# Altium schematic sheet Microprocessor.SchDoc
size A4; SheetNumber: 4; SheetTotal: 4
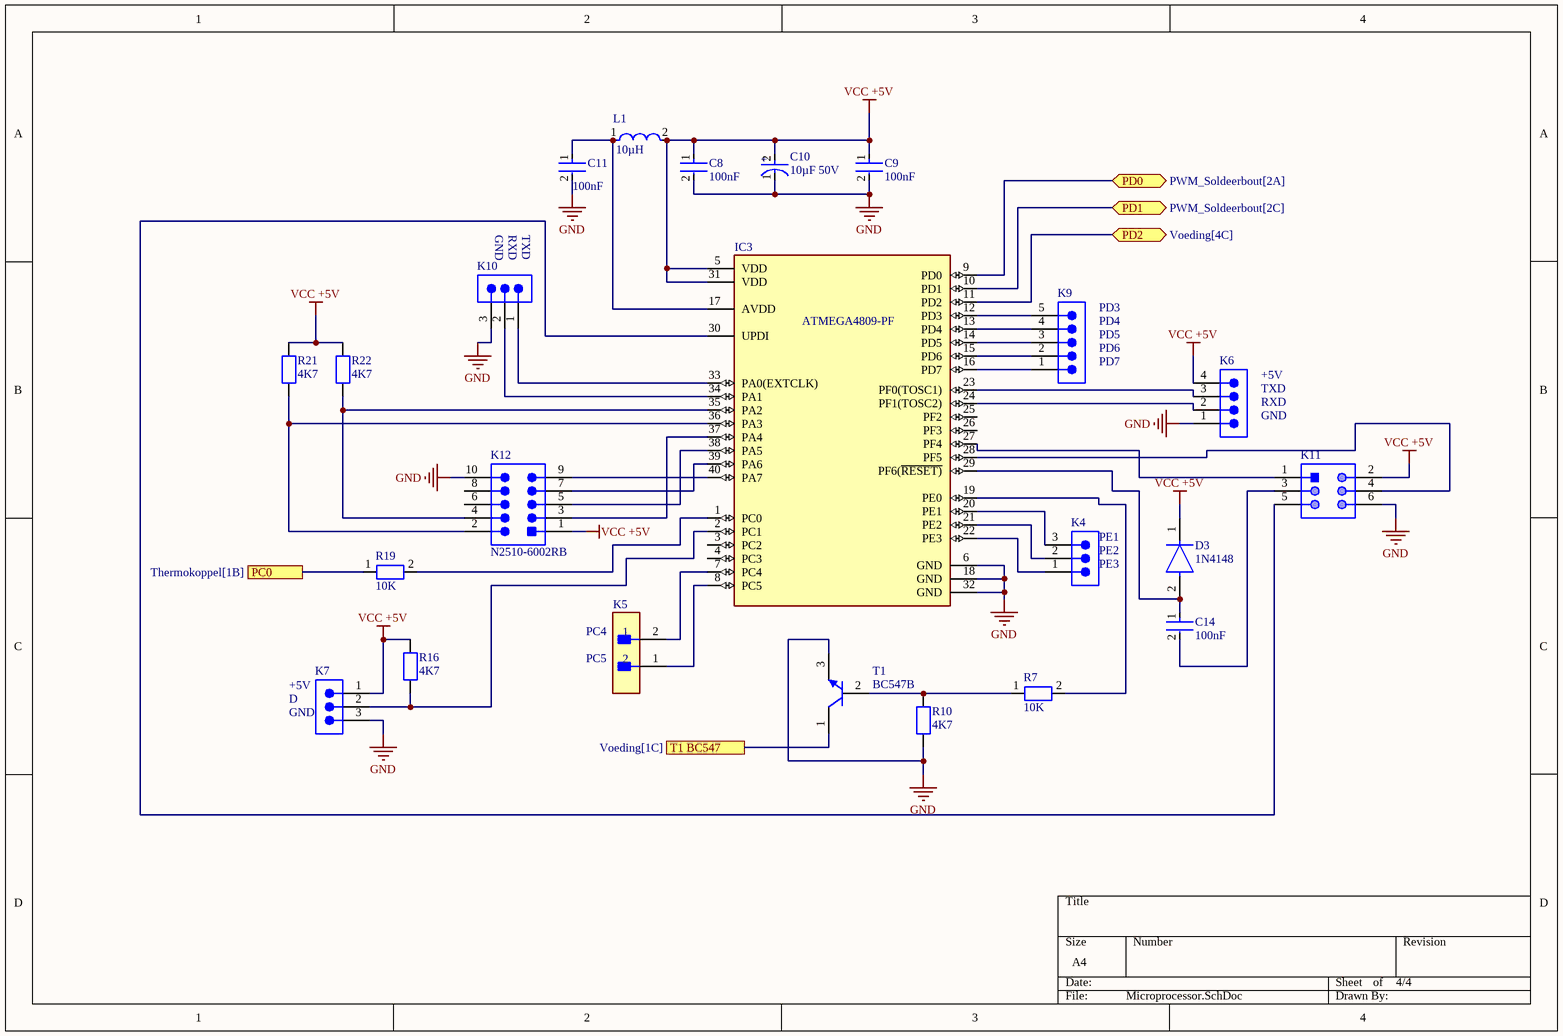
[diagram p0: Microprocessor.SchDoc]

## Parts
C8  100nF  [FP-C0805C-DN-IPC_A]
C9  100nF  [FP-C0805C-DN-IPC_A]
C10  10µF 50V  [cap 10µF 50V]
C11  100nF  [FP-C0805C-DN-IPC_A]
C14  100nF  [FP-C0805C-DN-IPC_A]
D3  1N4148  [1N4148]
IC3  ATMEGA4809-PF  [ATMEGCPU]
K4  (no value)  [Pinheader (1rij-3pin)]
K5  (no value)  [Pinheader (1rij-2pin)]
K6  (no value)  [Pinheader (1rij-4pin)]
K7  (no value)  [Pinheader (1rij-3pin)]
K9  (no value)  [Pinheader (1rij-5pin)]
K10  (no value)  [Pinheader (1rij-3pin)]
K11  (no value)  [Pinheader (2rij-6pin)]
K12  N2510-6002RB  [boxheader]
L1  10µH  [Spoel L1 10µH,130mA]
R7  10K  [Weerstand 1M ohm]
R10  4K7  [Weerstand 1M ohm]
R16  4K7  [Weerstand 1M ohm]
R19  10K  [Weerstand 1M ohm]
R21  4K7  [Weerstand 1M ohm]
R22  4K7  [Weerstand 1M ohm]
T1  BC547B  [sot23]

## Ports
PC0 (see Thermokoppel[1B]), PD0 (bidir, see PWM_Soldeerbout[2A]), PD1 (bidir, see PWM_Soldeerbout[2C]), PD2 (bidir, see Voeding[4C]), T1 BC547 (see Voeding[1C])

## Nets
GND: C8.2 C9.2 C10.1(C) C11.2 IC3.6(GND) IC3.18(GND) IC3.32(GND) K6.1 K7.3 K10.3 K11.6 K12.10 R10.1 T1.3(E)
VCC +5V: C8.1 C9.1 C10.2(A) D3.1(C) IC3.5(VDD) IC3.31(VDD) K6.4 K7.1 K11.2 K12.1 L1.2 R16.2 R21.2 R22.2
PC0: R19.1 ; port PC0
PD0: IC3.9(PD0) ; port PD0
PD1: IC3.10(PD1) ; port PD1
PD2: IC3.11(PD2) ; port PD2
T1 BC547: T1.1(C) ; port T1 BC547
NetC11_1: C11.1 IC3.17(AVDD) L1.1
NetC14_1: C14.1 D3.2(A) IC3.29(PF6(~{RESET)})
NetC14_2: C14.2 K11.3
NetIC3_1: IC3.1(PC0) R19.2
NetIC3_2: IC3.2(PC1) K7.2 R16.1
NetIC3_7: IC3.7(PC4) K5.2
NetIC3_8: IC3.8(PC5) K5.1
NetIC3_12: IC3.12(PD3) K9.5
NetIC3_13: IC3.13(PD4) K9.4
NetIC3_14: IC3.14(PD5) K9.3
NetIC3_15: IC3.15(PD6) K9.2
NetIC3_16: IC3.16(PD7) K9.1
NetIC3_19: IC3.19(PE0) R7.2
NetIC3_20: IC3.20(PE1) K4.3
NetIC3_21: IC3.21(PE2) K4.2
NetIC3_22: IC3.22(PE3) K4.1
NetIC3_23: IC3.23(PF0(TOSC1)) K6.3
NetIC3_24: IC3.24(PF1(TOSC2)) K6.2
NetIC3_27: IC3.27(PF4) K11.1
NetIC3_28: IC3.28(PF5) K11.4
NetIC3_30: IC3.30(UPDI) K11.5
NetIC3_33: IC3.33(PA0(EXTCLK)) K10.1
NetIC3_34: IC3.34(PA1) K10.2
NetIC3_35: IC3.35(PA2) K12.4 R22.1
NetIC3_36: IC3.36(PA3) K12.2 R21.1
NetIC3_37: IC3.37(PA4) K12.3
NetIC3_38: IC3.38(PA5) K12.5
NetIC3_39: IC3.39(PA6) K12.7
NetIC3_40: IC3.40(PA7) K12.9
NetR7_1: R7.1 R10.2 T1.2(B)

Not connected (* = marked no-connect by the designer): IC3 3(PC2) 4(PC3) 25(PF2) 26(PF3); K12 6 8

## Notes on the sheet
- (near K10) GND
- (near K10) RXD
- TXD
- (near K9) PD3
- (near K9) PD4
- (near K9) PD5
- (near K9) PD6
- (near K9) PD7
- (near K6) +5V
- (near K6) TXD
- (near K6) RXD
- GND
- (near K4) PE1
- (near K4) PE2
- (near K4) PE3
- (near K5) PC4
- (near K7) +5V
- (near K7) D
- (near K7) GND
- (near K5) PC5
- (in symbol 10µF 50V) +

## Library data of the parts
C8 C9 C11 C14 = cap 50V 100nF: Chip Multilayer Ceramic Capacitors for Automotive, 0805, 0.10uF, X7R, 15%, 10%, 50V, Grade 1; Case Code (Metric): 2012; Voltage Rating: 50V; Height: 1.25mm; Weight: 0.000335oz; Mount: Surface Mount; Width: 0.049inch; Packaging: Tape and Reel; Min Operating Temperature: -55°C; Depth: 1.25mm; Length: 2mm; Max Operating Temperature: 125°C; Ratings: AEC-Q200; Termination: SMD/SMT; Capacitance: 100nF; Thickness: 0.049inch; Case/Package: 0805; Voltage Rating (DC): 50V; Dielectric: X7R; Case Code (Imperial): 0805; Tolerance: 10%; Package Quantity: 3000
C10 = 10µF 50V: Aluminum Electrolytic Capacitors (Radial Lead Type) 10uF ±20% 50V; Lead Diameter: 0.5mm; Life (Hours): 5000Hour; Impedance: 340mR; Ripple Current (AC): 250mA; REACH SVHC: Yes; Tolerance: 20%; Construction: RADIAL; Min Operating Temperature: -40°C; Termination: Radial; Voltage Rating: 50V; Height: 11mm; Max Operating Temperature: 105°C; Capacitance: 10uF; Voltage: 50V; Diameter: 5mm; Lead Pitch: 2mm; Series: FR Radial; RoHS Compliant: Yes; Case/Package: Radial
D3 = 1N4148: DIODE GEN PURP 100V 200MA DO35; Forward Voltage: 1V; Max Power Dissipation: 500mW; Max Reverse Current: 5uA; Forward Current: 300mA; Current: 4A; Reverse Recovery Time: 4ns; Element Configuration: Single; Outside Diameter: 1.85mm; Capacitance: 4pF; Polarity: Standard; Max Forward Surge Current (Ifsm): 1A; Reverse Voltage: 100V; Output Current: 200mA; Average Rectified Current: 200mA; Diameter: 1.91mm; Max Repetitive Reverse Voltage (Vrrm): 100V; Current Rating: 200mA; Case/Package: DO-35; Lead Free: Lead Free; Number of Pins: 2; Recovery Time: 4ns; Packaging: Bulk; Contact Plating: Tin; Voltage: 100V; Mount: Through Hole; Max Surge Current: 4A; Package Quantity: 2000; Width: 1.91mm; Max Reverse Voltage (DC): 100V; Length: 4.56mm; Radiation Hardening: No; Power Dissipation: 500mW; Voltage Rating (DC): 100V; Peak Non-Repetitive Surge Current: 4A; REACH SVHC: No SVHC; Height: 4.56mm; Max Operating Temperature: 175°C; Series: -; Weight: 0.01lb; Min Operating Temperature: -65°C
IC3 = ATMEGA4809-PF: IC MCU 8BIT 48KB FLASH 40DIP; RoHS Compliant: Yes
K4 K7 K10 = Pinheader (1rij-3pin): 0.025" SQ Post Header, Through-hole, Vertical, -55 to 105 degC, 2.54 mm Pitch, 3-Pin, Male, RoHS; PartNumber: TSW-103-07-T-S; Manufacturer: Samtec; Pitch: 2.54 mm; ComponentLink1URL: http://www.samtec.com; ComponentLink3URL: http://www.samtec.com/documents/webfiles/cpdf/TSW-XXX-XX-XXX-X-XX-XXX-MKT.pdf; Mounting Technology: Through-hole; RoHS: True; DatasheetVersion: F-214; PackageVersion: DM, 8/1988; Temperature Range: -55 to 105 degC; ComponentLink2Description: Datasheet; ComponentLink1Description: Manufacturer URL; Orientation: Vertical; PackageReference: TSW-103-07-X-S; ComponentLink3Description: Package Specification; ComponentLink2URL: http://www.samtec.com/documents/webfiles/pdf/TSW_TH.PDF; PackageDescription: .025[0.64] SQ. Post Terminal Strip Assembly
K5 = Pinheader (1rij-2pin): CONN HEADER VERT 2POS 2.54MM; Manufacturer: Harwin; Manufacturer Part Number: M20-9990246; Conn Gender: Male; Conn Orientation: Vertical; Number Of Contacts: 2; Current Rating: 3A; ComponentLink2URL: https://cdn.harwin.com/pdfs/M20-999.pdf; ComponentLink2Description: Datasheet; Package: M20-9990246; Temperature: -40°C to +105°C; Octopart: https://octopart.com/m20-9990246-harwin-2590635; Mouser Description: 2.54mm (0.1") Pitch SIL Vertical PC Tail Pin Header, 6.1mm mating pin height, tin, 2 contacts; Temperature Range High: +105°C; Device Class L1: Connectors; RoHS: TRUE; Automotive: No; Height: 8.99mm; Number Of Rows: 1; Contact Material: Tin,Nickel; Category: Conn; Pitch: 2.54mm; Lead Free: Yes; Digikey Description: CONN HEADER VERT 2POS 2.54MM; Temperature Range Low: -40°C; Device Class L3: unset; Device Class L2: Headers and Wire Housings
K6 = Pinheader (1rij - 4pin): 0.025" SQ Post Header, Through-hole, Vertical, -55 to 125 degC, 2.54 mm Pitch, 4-Pin, Male, RoHS; PartNumber: TSW-104-08-L-S; Manufacturer: Samtec; Pitch: 2.54 mm; RoHS: True; Temperature Range: -55 to 125 degC; PackageDescription: .025[0.64] SQ. Post Terminal Strip Assembly; Orientation: Vertical; ComponentLink2URL: http://www.samtec.com/documents/webfiles/pdf/TSW_TH.PDF; ComponentLink1Description: Manufacturer URL; ComponentLink2Description: Datasheet; PackageVersion: DM, 8/1988; ComponentLink3URL: http://www.samtec.com/documents/webfiles/cpdf/TSW-XXX-XX-XXX-X-XX-XXX-MKT.pdf; Mounting Technology: Through-hole; PackageReference: TSW-104-08-X-S; ComponentLink3Description: Package Specification; ComponentLink1URL: http://www.samtec.com; DatasheetVersion: F-214
K9 = Pinheader (1rij-5pin): 0.025" SQ Post Header, Through-hole, Vertical, -55 to 125 degC, 2.54 mm Pitch, 5-Pin, Male, RoHS; PartNumber: TSW-105-05-F-S; Manufacturer: Samtec; Pitch: 2.54 mm; PackageReference: TSW-105-05-X-S; ComponentLink1Description: Manufacturer URL; Temperature Range: -55 to 125 degC; ComponentLink2Description: Datasheet; ComponentLink2URL: http://www.samtec.com/documents/webfiles/pdf/TSW_TH.PDF; ComponentLink3URL: http://www.samtec.com/documents/webfiles/cpdf/TSW-XXX-XX-XXX-X-XX-XXX-MKT.pdf; ComponentLink1URL: http://www.samtec.com; DatasheetVersion: F-214; Mounting Technology: Through-hole; RoHS: True; PackageVersion: DM, 8/1988; ComponentLink3Description: Package Specification; PackageDescription: .025[0.64] SQ. Post Terminal Strip Assembly; Orientation: Vertical
K11 = Pinheader (2rij-6pin): THT Vertical Pin Header WR-PHD, Pitch 2.54 mm, Dual Row, 6 pins; Manufacturer: Wurth Elektronik; Part Number: 61300621121; Contact Resistance: 20mOhm; Withstanding Voltage: 500VAC; Pin Number: 6; Gender: Male; Pitch: 2.54mm; Working Voltage: 250VAC; Rated Current: 3A; Packaging: Bag; Row Number: Dual; Manufacturer URL: http://www.we-online.de; Operating Temperature: -40to105degC; Mounting Technology: THT; Package Reference: 61300621121; Datasheet URL: https://katalog.we-online.de/em/datasheet/6130xx21121.pdf; Orientation: Vertical; Publisher: WurthElektronik
K12 = boxheader: Male Header, Pitch 2.54 mm, 2 x 5 Postion, Height 9.91 mm, Tail Length 2.84 mm, -55 to 105 degC, RoHS, Bulk; PartNumber: N2510; Manufacturer: 3M; Package Version: Rev. M, 08/2014; Rad Hard: No; No. of Rows: 2; Number of Contacts: 10; Pitch: 2.54mm; Termination Method: Solder; Manufacturer URL: http://www.3m.com/; Package Description: 10-Pin Through Hole Device, Body 20.02 x 8.59 mm, Pitch 2.54 mm; Gender: Male; Number of Rows: 2; Orientation: Straight; Contact Plating: GoldOverNickel; Packaging: Rail/Tube; Mounting Technology: ThroughHole; Datasheet URL: https://datasheet.ciiva.com/11746/0900766b807b18da-11746957.pdf; Package Reference: N2510-6002-10; Datasheet Version: 05/2007; No. of Positions: 10; Package URL: http://multimedia.3m.com/mws/media/330367O/3mtm-100-in-4-wall-hdr-rohs-lp-straightra-hitemp-ts0770.pdf; Type: ShroudedHeader
L1 = Spoel L1 10µH,130mA: IR-2 10 10% B08; Obsolete Part: true; Manufacturer: Vishay Dale; Manufacturer Part Number: IR02BH100K; Core Material: Iron; Value: 10uH; Test Frequency: 7.9MHz; Saturation Current: 130mA; Series Resistance: 3.7Ω; Q Factor: 55; Self Resonant Frequency: 50MHz; Device Class L2: Inductors; ComponentLink2Description: Datasheet; Temperature Range Low: -55°C; Digikey Description: IR-2 10 10% B08; Temperature Range High: +105°C; Inductance: 10uH; Height: 3.05mm; Package: IR02; Tolerance: 10%; Device Class L1: Passive Components; Category: Ind; Device Class L3: Fixed Inductors; RoHS: TRUE; Octopart: https://octopart.com/ir02bh100k-vishay+dale-39675774; Temperature: -55°C to +105°C; Ipc Land Pattern Name: CAPAD1147W70L838D305; Lead Free: Yes; ComponentLink2URL: https://datasheet.ciiva.com/8536/ir-8536517.pdf; Automotive: No; Mouser Description: Fixed Inductors 10uH 10%
R7 R19 = Weerstand 10K ohm: RES Thick Film, 10kΩ, 1%, 0.125W, 100ppm/°C, 0805; Resistance: 10kR; Voltage Rating (DC): 150V; Power Rating: 125mW; Weight: 0.000194oz; Package Quantity: 5000; Military Standard: Not; Max Operating Temperature: 155°C; Temperature Coefficient: 100ppm/°C; Contact Plating: Tin; Width: 1.25mm; Height: 0.45mm; Radiation Hardening: No; Tolerance: 1%; Min Operating Temperature: -55°C; Voltage Rating: 150V; Length: 2mm; Depth: 1.25mm; Termination: SMD/SMT; Packaging: Tape and Reel; Case/Package: 0805; Case Code (Metric): 2012; Lead Free: Lead Free; Case Code (Imperial): 0805; Composition: Thick Film
R10 R16 R21 R22 = Weerstand 4K7 ohm: Manufacturer: Vishay Dale; Part Number: CRCW08054K70JNEB
T1 = sot23 (bc547): Amplifier Transistor, NPN Silicon, 3-Pin TO-92, Bulk Box; Manufacturer: On Semiconductor; IC Continuous (A): 0.1; fT Min (MHz): 150; DatasheetVersion: Rev. 7; ComponentLink1URL: http://www.onsemi.com/; Polarity: NPN; RoHS: FALSE; ComponentLink1Description: Manufacturer URL; Packing: Bulk Box; PackageDescription: 3-Pin Transistor Outline, Body 4.825 x 3.685 mm, Pitch 1.27 mm; ComponentLink3URL: http://www.onsemi.cn/pub_link/Collateral/2N6426-D.PDF; ComponentLink2Description: Datasheet; PackageVersion: Rev. AM; PackageReference: TO-92-3-29-11_AM_SL; ComponentLink3Description: Package Specification; Mounting Technology: Through Hole; PartNumber: BC547B; ComponentLink2URL: http://www.onsemi.com/pub_link/Collateral/BC546-D.PDF